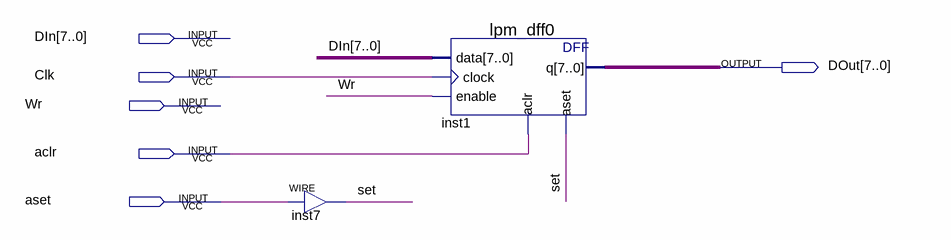
[diagram p0: schematic sheet]
// Quartus schematic test_dff.bdf as structural Verilog: 2 symbols, 6 pins
module test_dff (
  input  [7:0] DIn,
  input  Clk,
  input  Wr,
  input  aclr,
  input  aset,
  output [7:0] DOut
);

  wire set;

  assign set = aset;  // WIRE inst7
  lpm_dff0 inst1 (.data(DIn), .clock(Clk), .enable(Wr), .aclr(aclr), .aset(set), .q(DOut));
endmodule
